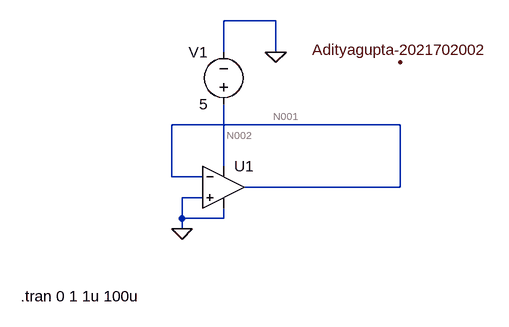
[diagram p0: schematic Draft2.asc]
Draft2.asc, the LTspice schematic file:
Version 4
SHEET 1 880 680
WIRE 272 -128 192 -128
WIRE 192 -80 192 -128
WIRE 272 -80 272 -128
WIRE 464 32 112 32
WIRE 192 96 192 0
WIRE 112 112 112 32
WIRE 160 112 112 112
WIRE 464 128 464 32
WIRE 464 128 224 128
WIRE 160 144 128 144
WIRE 128 176 128 144
WIRE 192 176 192 160
WIRE 192 176 128 176
WIRE 128 192 128 176
FLAG 128 192 0
FLAG 272 -80 0
FLAG 464 -64 Adityagupta-2021702002
SYMBOL voltage 192 16 R180
WINDOW 0 24 96 Left 2
WINDOW 3 24 16 Left 2
WINDOW 123 0 0 Left 0
WINDOW 39 0 0 Left 0
SYMATTR InstName V1
SYMATTR Value 5
SYMBOL OpAmps\\UniversalOpamp2 192 128 R0
SYMATTR InstName U1
TEXT -120 296 Left 2 !.tran 0 1 1u 100u

The netlist it stands for:
* Draft2.asc
V1 N002 0 5
XU1 0 N001 N002 0 N001 level.2 Avol=1Meg GBW=10Meg Slew=10Meg ilimit=25m rail=0 Vos=0 phimargin=45 en=0 enk=0 in=0 ink=0 Rin=500Meg  ; pins IN+ IN- V+ V- OUT
.tran 0 1 1u 100u
.lib UniversalOpamps2.sub
.backanno
.end

* Results of the author's LTspice run, read from the files saved beside the schematic
* Operating Point, zero values left out:
*   V(n002) = 5 V
*   V(n001) = 3.376 mV
*   I(V1) = -13.02 µA
*   Ix(u1:1) = -5 nA
*   Ix(u1:2) = -4.993 nA
*   Ix(u1:3) = 13.02 µA
*   Ix(u1:4) = -12.99 µA
*   Ix(u1:5) = 4.993 nA